# Altium schematic sheet btretro_main.SchDoc
size 508 x 431 mm
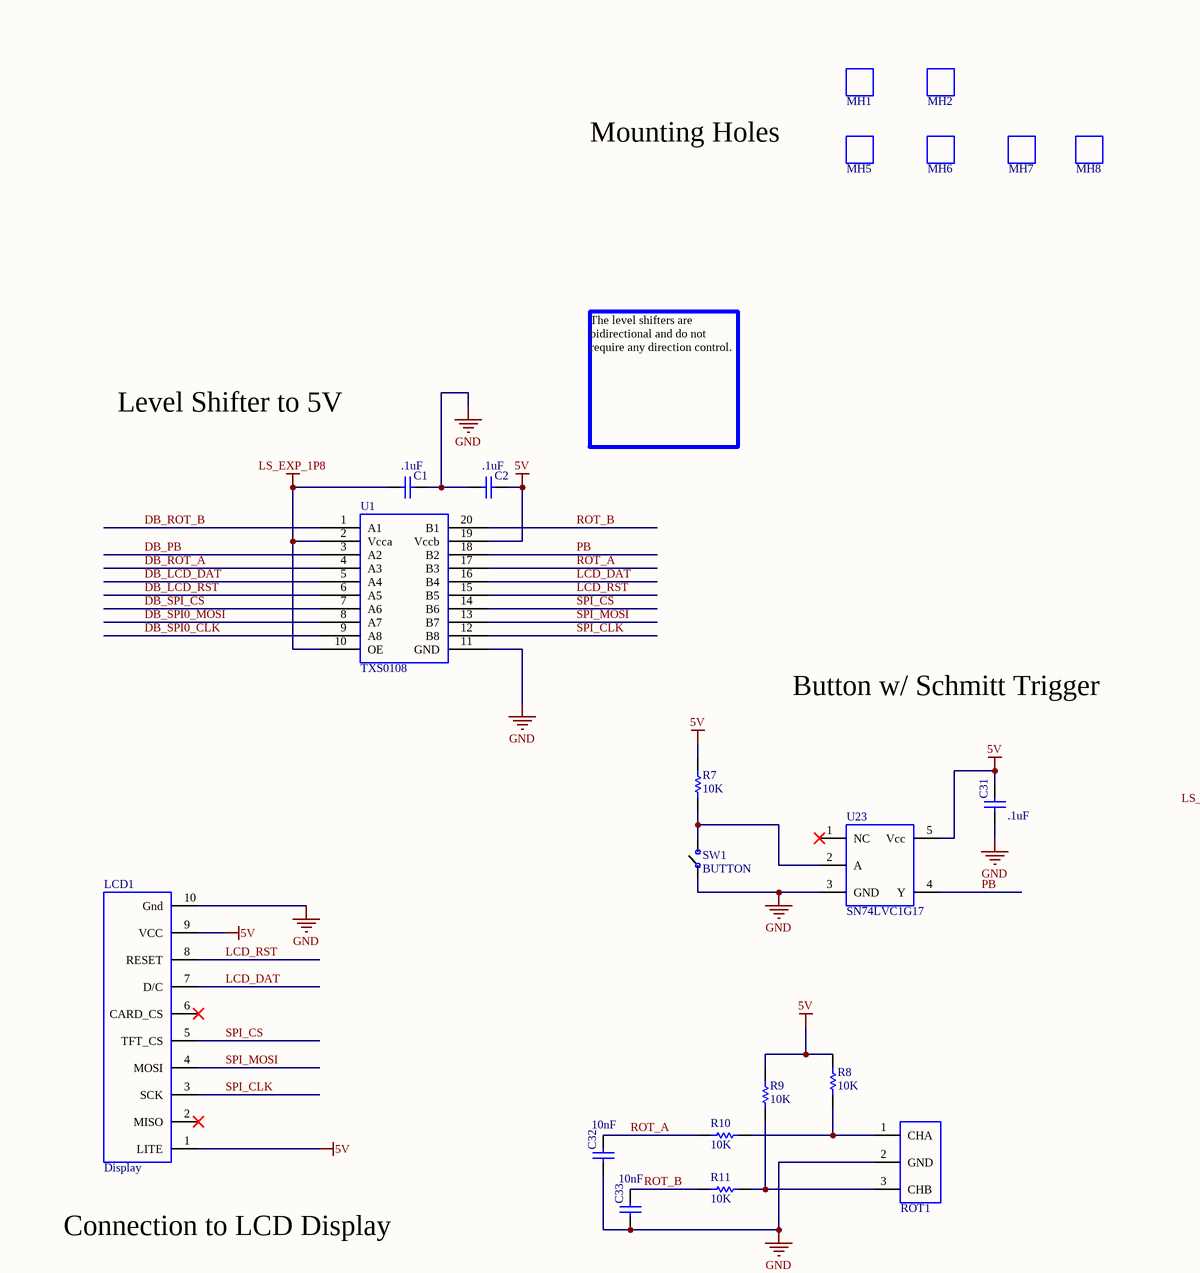
[diagram p0: btretro_main.SchDoc, top left]
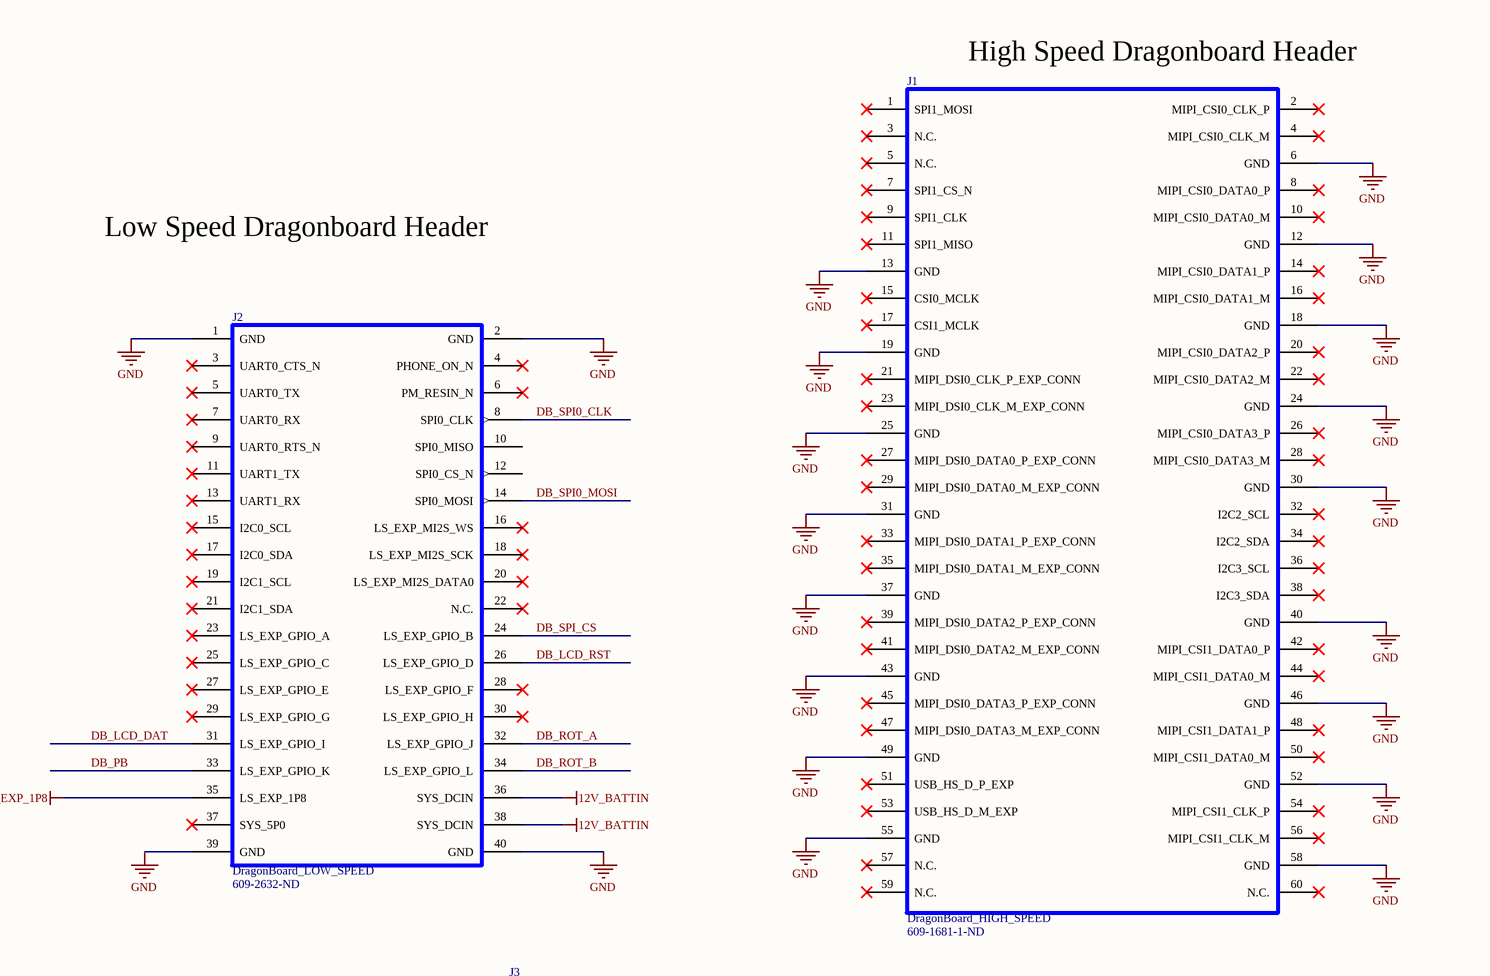
[diagram p1: btretro_main.SchDoc, top right]
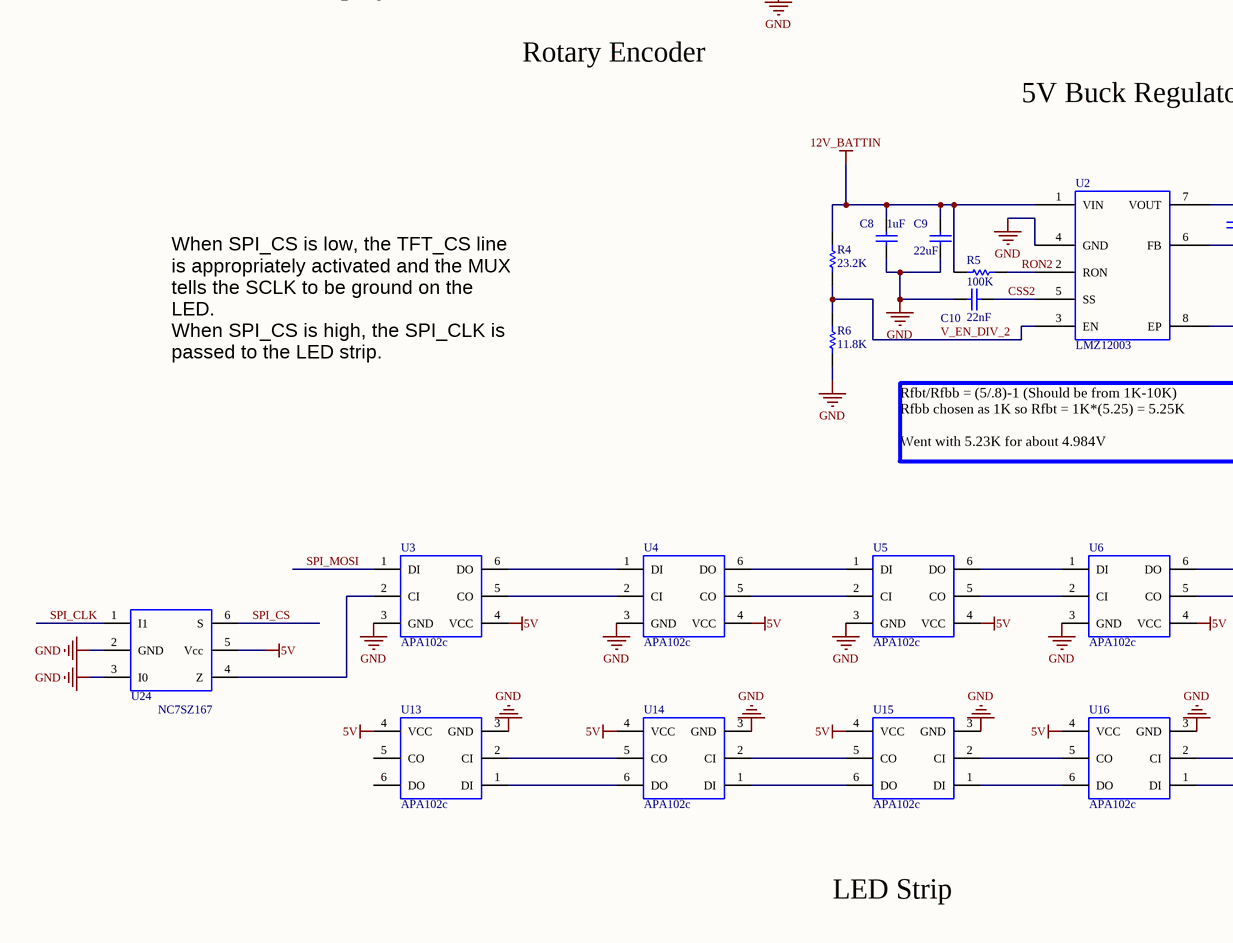
[diagram p2: btretro_main.SchDoc, bottom left]
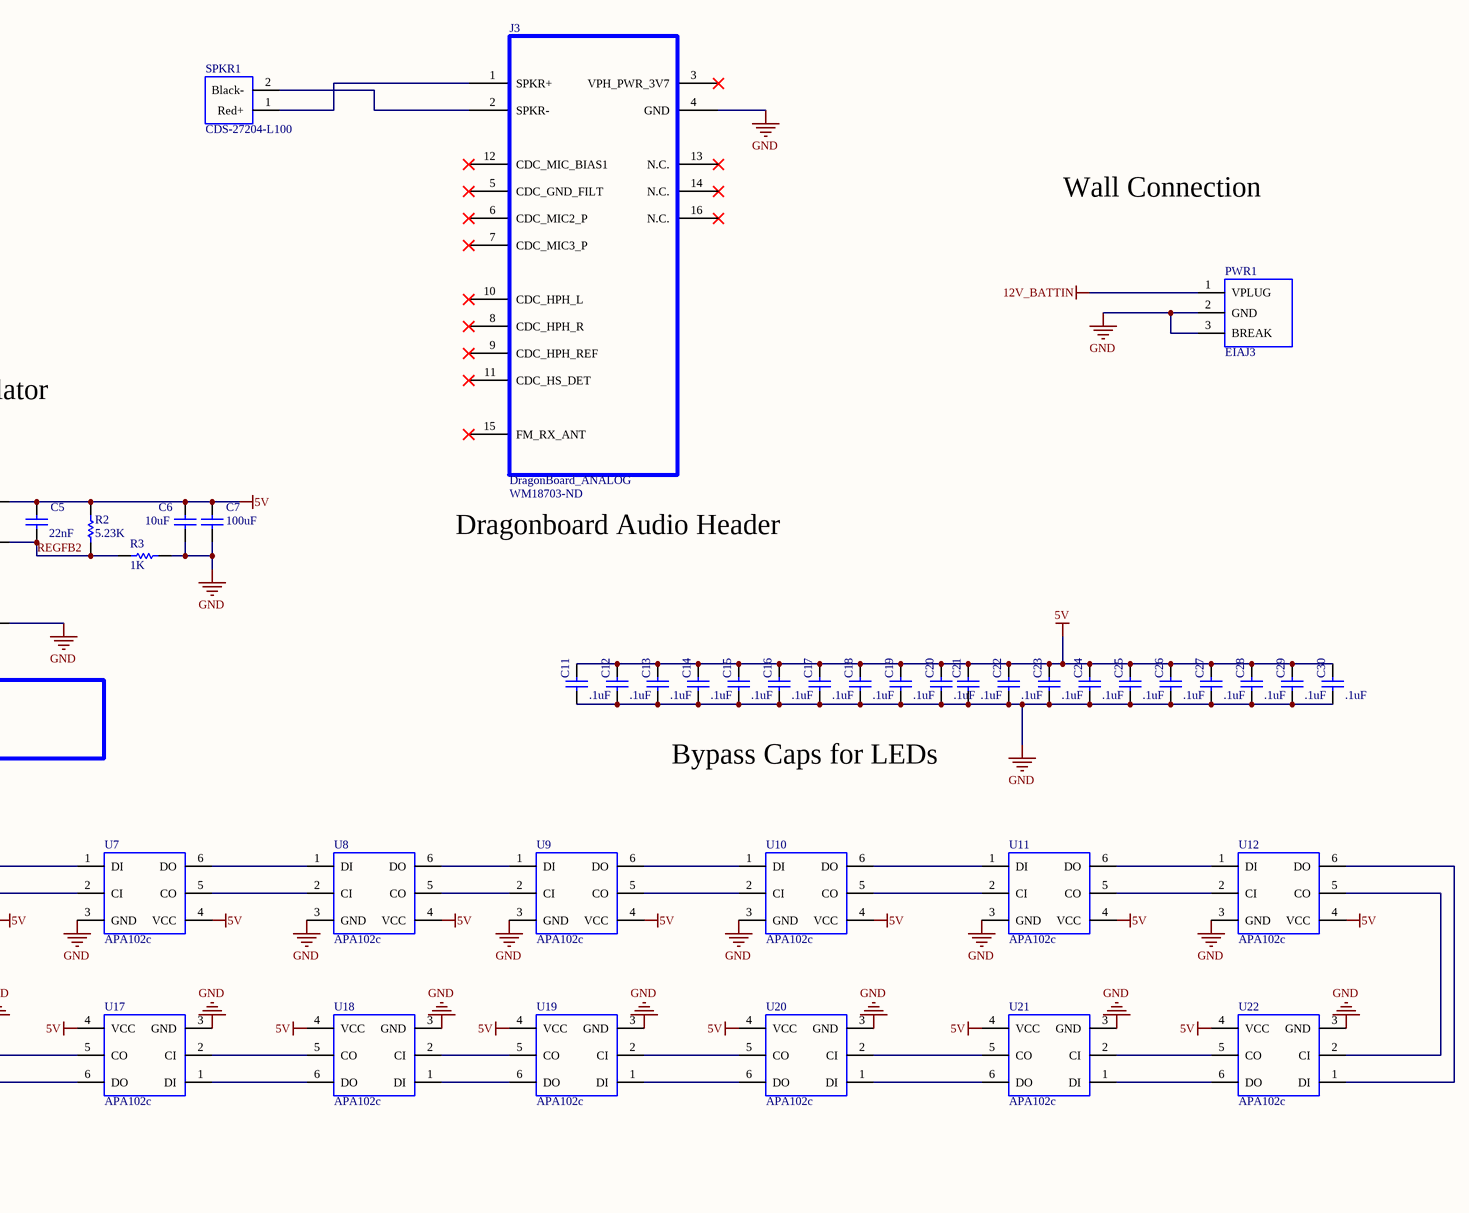
[diagram p3: btretro_main.SchDoc, bottom right]

## Parts
C1  value .1uF  [CAPC2012X135N]  (hidden comment: CAP_0805_.1u_250V)
C2  value .1uF  [CAPC2012X135N]  (hidden comment: CAP_0805_.1u_250V)
C5  value 22nF  [CAPC2012X135N]  (hidden comment: CAP_0805_m22n)
C6  value 10uF  [CAPC2012X135N]  (hidden comment: CAP_0805_10u_16V)
C7  value 100uF  [FP_1210]  (hidden comment: CAP_1210_100u_10V)
C8  value 1uF  [CAPC2012X135N]  (hidden comment: CAP_0805_1u_100V)
C9  value 22uF  [CAPC2012X135N]  (hidden comment: CAP_0805_22u_25V)
C10  value 22nF  [CAPC2012X135N]  (hidden comment: CAP_0805_m22n)
C11  value .1uF  [CAPC2012X135N]  (hidden comment: CAP_0805_.1u_250V)
C12  value .1uF  [CAPC2012X135N]  (hidden comment: CAP_0805_.1u_250V)
C13  value .1uF  [CAPC2012X135N]  (hidden comment: CAP_0805_.1u_250V)
C14  value .1uF  [CAPC2012X135N]  (hidden comment: CAP_0805_.1u_250V)
C15  value .1uF  [CAPC2012X135N]  (hidden comment: CAP_0805_.1u_250V)
C16  value .1uF  [CAPC2012X135N]  (hidden comment: CAP_0805_.1u_250V)
C17  value .1uF  [CAPC2012X135N]  (hidden comment: CAP_0805_.1u_250V)
C18  value .1uF  [CAPC2012X135N]  (hidden comment: CAP_0805_.1u_250V)
C19  value .1uF  [CAPC2012X135N]  (hidden comment: CAP_0805_.1u_250V)
C20  value .1uF  [CAPC2012X135N]  (hidden comment: CAP_0805_.1u_250V)
C21  value .1uF  [CAPC2012X135N]  (hidden comment: CAP_0805_.1u_250V)
C22  value .1uF  [CAPC2012X135N]  (hidden comment: CAP_0805_.1u_250V)
C23  value .1uF  [CAPC2012X135N]  (hidden comment: CAP_0805_.1u_250V)
C24  value .1uF  [CAPC2012X135N]  (hidden comment: CAP_0805_.1u_250V)
C25  value .1uF  [CAPC2012X135N]  (hidden comment: CAP_0805_.1u_250V)
C26  value .1uF  [CAPC2012X135N]  (hidden comment: CAP_0805_.1u_250V)
C27  value .1uF  [CAPC2012X135N]  (hidden comment: CAP_0805_.1u_250V)
C28  value .1uF  [CAPC2012X135N]  (hidden comment: CAP_0805_.1u_250V)
C29  value .1uF  [CAPC2012X135N]  (hidden comment: CAP_0805_.1u_250V)
C30  value .1uF  [CAPC2012X135N]  (hidden comment: CAP_0805_.1u_250V)
C31  value .1uF  [CAPC2012X135N]  (hidden comment: CAP_0805_.1u_250V)
C32  Capacitance: 10nF  [CAPC2012X135N]  (hidden comment: CAP_0805_10n_250V)
C33  Capacitance: 10nF  [CAPC2012X135N]  (hidden comment: CAP_0805_10n_250V)
J1  DragonBoard_HIGH_SPEED  Supplier Part Number 1: 609-1681-1-ND  [DB_HIGH_SPEED]
J2  DragonBoard_LOW_SPEED  Supplier Part Number 1: 609-2632-ND  [57202_40_PIN_HEADER]
J3  DragonBoard_ANALOG  Supplier Part Number 1: WM18703-ND  [16_PIN_ANALOG_CONN]
LCD1  Display  [LCD_HOLES]
MH1  MOUNTHOLES  [HOLE_BTRETRO]  (value not drawn)
MH2  MOUNTHOLES  [HOLE_BTRETRO]  (value not drawn)
MH5  MOUNTHOLES  [HOLE_BTRETRO]  (value not drawn)
MH6  MOUNTHOLES  [HOLE_BTRETRO]  (value not drawn)
MH7  MOUNTHOLES  [HOLE_BTRETRO]  (value not drawn)
MH8  MOUNTHOLES  [HOLE_BTRETRO]  (value not drawn)
PWR1  EIAJ3  [EIAJ3 BARREL]
R2  RES_5.23K  [RES0805]  (value not drawn)
R3  RES_0805_1K  [RES0805]  (value not drawn)
R4  RES_0805_23.2K  [RES0805]  (value not drawn)
R5  RES_0805_100K  [RES0805]  (value not drawn)
R6  RES_0805_11.8K  [RES0805]  (value not drawn)
R7  Resistance: 10K  [RES0805]  (hidden comment: RES_0805_10K)
R8  Resistance: 10K  [RES0805]  (hidden comment: RES_0805_10K)
R9  Resistance: 10K  [RES0805]  (hidden comment: RES_0805_10K)
R10  Resistance: 10K  [RES0805]  (hidden comment: RES_0805_10K)
R11  Resistance: 10K  [RES0805]  (hidden comment: RES_0805_10K)
ROT1  ROT_ENCODER  [ROTENCFP]  (value not drawn)
SPKR1  CDS-27204-L100  [SPK_BTRETRO]
SW1  BUTTON  [BUTTON]
U1  TXS0108  [TSSOP20]
U2  LMZ12003  [TO-PMOD-7]
U3  APA102c  [LED_APA]
U4  APA102c  [LED_APA]
U5  APA102c  [LED_APA]
U6  APA102c  [LED_APA]
U7  APA102c  [LED_APA]
U8  APA102c  [LED_APA]
U9  APA102c  [LED_APA]
U10  APA102c  [LED_APA]
U11  APA102c  [LED_APA]
U12  APA102c  [LED_APA]
U13  APA102c  [LED_APA]
U14  APA102c  [LED_APA]
U15  APA102c  [LED_APA]
U16  APA102c  [LED_APA]
U17  APA102c  [LED_APA]
U18  APA102c  [LED_APA]
U19  APA102c  [LED_APA]
U20  APA102c  [LED_APA]
U21  APA102c  [LED_APA]
U22  APA102c  [LED_APA]
U23  SN74LVC1G17  [DBV0005A (SOT-23)]
U24  NC7SZ167  [SC70]

## Nets
5V: C2.2 C5.2 C6.2 C7.2 C11.2 C12.2 C13.2 C14.2 C15.2 C16.2 C17.2 C18.2 C19.2 C20.2 C21.2 C22.2 C23.2 C24.2 C25.2 C26.2 C27.2 C28.2 C29.2 C30.2 C31.2 LCD1.1(LITE) LCD1.9(VCC) R2.2 R7.2 R8.2 R9.2 U1.19(Vccb) U2.7(VOUT) U3.4(VCC) U4.4(VCC) U5.4(VCC) U6.4(VCC) U7.4(VCC) U8.4(VCC) U9.4(VCC) U10.4(VCC) U11.4(VCC) U12.4(VCC) U13.4(VCC) U14.4(VCC) U15.4(VCC) U16.4(VCC) U17.4(VCC) U18.4(VCC) U19.4(VCC) U20.4(VCC) U21.4(VCC) U22.4(VCC) U23.5(Vcc) U24.5(Vcc)
12V_BATTIN: C8.2 C9.2 J2.36(SYS_DCIN) J2.38(SYS_DCIN) PWR1.1(VPLUG) R4.2 R5.1 U2.1(VIN)
GND: C1.2 C2.1 C6.1 C7.1 C8.1 C9.1 C10.1 C11.1 C12.1 C13.1 C14.1 C15.1 C16.1 C17.1 C18.1 C19.1 C20.1 C21.1 C22.1 C23.1 C24.1 C25.1 C26.1 C27.1 C28.1 C29.1 C30.1 C31.1 C32.1 C33.1 J1.6(GND) J1.12(GND) J1.13(GND) J1.18(GND) J1.19(GND) J1.24(GND) J1.25(GND) J1.30(GND) J1.31(GND) J1.37(GND) J1.40(GND) J1.43(GND) J1.46(GND) J1.49(GND) J1.52(GND) J1.55(GND) J1.58(GND) J2.1(GND) J2.2(GND) J2.39(GND) J2.40(GND) J3.4(GND) LCD1.10(Gnd) PWR1.2(GND) PWR1.3(BREAK) R3.2 R6.1 ROT1.2(GND) SW1.2 U1.11(GND) U2.4(GND) U2.8(EP) U3.3(GND) U4.3(GND) U5.3(GND) U6.3(GND) U7.3(GND) U8.3(GND) U9.3(GND) U10.3(GND) U11.3(GND) U12.3(GND) U13.3(GND) U14.3(GND) U15.3(GND) U16.3(GND) U17.3(GND) U18.3(GND) U19.3(GND) U20.3(GND) U21.3(GND) U22.3(GND) U23.3(GND) U24.2(GND) U24.3(I0)
LS_EXP_1P8: C1.1 J2.35(LS_EXP_1P8) U1.2(Vcca) U1.10(OE)
CSS2: C10.2 U2.5(SS)
DB_LCD_DAT: J2.31(LS_EXP_GPIO_I) U1.5(A4)
DB_LCD_RST: J2.26(LS_EXP_GPIO_D) U1.6(A5)
DB_PB: J2.33(LS_EXP_GPIO_K) U1.3(A2)
DB_ROT_A: J2.32(LS_EXP_GPIO_J) U1.4(A3)
DB_ROT_B: J2.34(LS_EXP_GPIO_L) U1.1(A1)
DB_SPI0_CLK: J2.8(SPI0_CLK) U1.9(A8)
DB_SPI0_MOSI: J2.14(SPI0_MOSI) U1.8(A7)
DB_SPI_CS: J2.24(LS_EXP_GPIO_B) U1.7(A6)
LCD_DAT: LCD1.7(D/C) U1.16(B4)
LCD_RST: LCD1.8(RESET) U1.15(B5)
PB: U1.18(B2) U23.4(Y)
REGFB2: C5.1 R2.1 R3.1 U2.6(FB)
RON2: R5.2 U2.2(RON)
ROT_A: C32.2 R10.1 U1.17(B3)
ROT_B: C33.2 R11.1 U1.20(B1)
SPI_CLK: LCD1.3(SCK) U1.12(B8) U24.1(I1)
SPI_CS: LCD1.5(TFT_CS) U1.14(B6) U24.6(S)
SPI_MOSI: LCD1.4(MOSI) U1.13(B7) U3.1(DI)
V_EN_DIV_2: R4.1 R6.2 U2.3(EN)
NetJ3_1: J3.1(SPKR+) SPKR1.1(Red+)
NetJ3_2: J3.2(SPKR-) SPKR1.2(Black-)
NetR7_1: R7.1 SW1.1 U23.2(A)
NetR8_1: R8.1 R10.2 ROT1.1(CHA)
NetR9_1: R9.1 R11.2 ROT1.3(CHB)
NetU3_2: U3.2(CI) U24.4(Z)
NetU3_5: U3.5(CO) U4.2(CI)
NetU3_6: U3.6(DO) U4.1(DI)
NetU4_5: U4.5(CO) U5.2(CI)
NetU4_6: U4.6(DO) U5.1(DI)
NetU5_5: U5.5(CO) U6.2(CI)
NetU5_6: U5.6(DO) U6.1(DI)
NetU6_5: U6.5(CO) U7.2(CI)
NetU6_6: U6.6(DO) U7.1(DI)
NetU7_5: U7.5(CO) U8.2(CI)
NetU7_6: U7.6(DO) U8.1(DI)
NetU8_5: U8.5(CO) U9.2(CI)
NetU8_6: U8.6(DO) U9.1(DI)
NetU9_5: U9.5(CO) U10.2(CI)
NetU9_6: U9.6(DO) U10.1(DI)
NetU10_5: U10.5(CO) U11.2(CI)
NetU10_6: U10.6(DO) U11.1(DI)
NetU11_5: U11.5(CO) U12.2(CI)
NetU11_6: U11.6(DO) U12.1(DI)
NetU12_5: U12.5(CO) U22.2(CI)
NetU12_6: U12.6(DO) U22.1(DI)
NetU13_1: U13.1(DI) U14.6(DO)
NetU13_2: U13.2(CI) U14.5(CO)
NetU14_1: U14.1(DI) U15.6(DO)
NetU14_2: U14.2(CI) U15.5(CO)
NetU15_1: U15.1(DI) U16.6(DO)
NetU15_2: U15.2(CI) U16.5(CO)
NetU16_1: U16.1(DI) U17.6(DO)
NetU16_2: U16.2(CI) U17.5(CO)
NetU17_1: U17.1(DI) U18.6(DO)
NetU17_2: U17.2(CI) U18.5(CO)
NetU18_1: U18.1(DI) U19.6(DO)
NetU18_2: U18.2(CI) U19.5(CO)
NetU19_1: U19.1(DI) U20.6(DO)
NetU19_2: U19.2(CI) U20.5(CO)
NetU20_1: U20.1(DI) U21.6(DO)
NetU20_2: U20.2(CI) U21.5(CO)
NetU21_1: U21.1(DI) U22.6(DO)
NetU21_2: U21.2(CI) U22.5(CO)

Not connected (* = marked no-connect by the designer): J1 1(SPI1_MOSI)* 2(MIPI_CSI0_CLK_P)* 3(N.C.)* 4(MIPI_CSI0_CLK_M)* 5(N.C.)* 7(SPI1_CS_N)* 8(MIPI_CSI0_DATA0_P)* 9(SPI1_CLK)* 10(MIPI_CSI0_DATA0_M)* 11(SPI1_MISO)* 14(MIPI_CSI0_DATA1_P)* 15(CSI0_MCLK)* 16(MIPI_CSI0_DATA1_M)* 17(CSI1_MCLK)* 20(MIPI_CSI0_DATA2_P)* 21(MIPI_DSI0_CLK_P_EXP_CONN)* 22(MIPI_CSI0_DATA2_M)* 23(MIPI_DSI0_CLK_M_EXP_CONN)* 26(MIPI_CSI0_DATA3_P)* 27(MIPI_DSI0_DATA0_P_EXP_CONN)* 28(MIPI_CSI0_DATA3_M)* 29(MIPI_DSI0_DATA0_M_EXP_CONN)* 32(I2C2_SCL)* 33(MIPI_DSI0_DATA1_P_EXP_CONN)* 34(I2C2_SDA)* 35(MIPI_DSI0_DATA1_M_EXP_CONN)* 36(I2C3_SCL)* 38(I2C3_SDA)* 39(MIPI_DSI0_DATA2_P_EXP_CONN)* 41(MIPI_DSI0_DATA2_M_EXP_CONN)* 42(MIPI_CSI1_DATA0_P)* 44(MIPI_CSI1_DATA0_M)* 45(MIPI_DSI0_DATA3_P_EXP_CONN)* 47(MIPI_DSI0_DATA3_M_EXP_CONN)* 48(MIPI_CSI1_DATA1_P)* 50(MIPI_CSI1_DATA0_M)* 51(USB_HS_D_P_EXP)* 53(USB_HS_D_M_EXP)* 54(MIPI_CSI1_CLK_P)* 56(MIPI_CSI1_CLK_M)* 57(N.C.)* 59(N.C.)* 60(N.C.)*; J2 3(UART0_CTS_N)* 4(PHONE_ON_N)* 5(UART0_TX)* 6(PM_RESIN_N)* 7(UART0_RX)* 9(UART0_RTS_N)* 10(SPI0_MISO) 11(UART1_TX)* 12(SPI0_CS_N) 13(UART1_RX)* 15(I2C0_SCL)* 16(LS_EXP_MI2S_WS)* 17(I2C0_SDA)* 18(LS_EXP_MI2S_SCK)* 19(I2C1_SCL)* 20(LS_EXP_MI2S_DATA0)* 21(I2C1_SDA)* 22(N.C.)* 23(LS_EXP_GPIO_A)* 25(LS_EXP_GPIO_C)* 27(LS_EXP_GPIO_E)* 28(LS_EXP_GPIO_F)* 29(LS_EXP_GPIO_G)* 30(LS_EXP_GPIO_H)* 37(SYS_5P0)*; J3 3(VPH_PWR_3V7)* 5(CDC_GND_FILT)* 6(CDC_MIC2_P)* 7(CDC_MIC3_P)* 8(CDC_HPH_R)* 9(CDC_HPH_REF)* 10(CDC_HPH_L)* 11(CDC_HS_DET)* 12(CDC_MIC_BIAS1)* 13(N.C.)* 14(N.C.)* 15(FM_RX_ANT)* 16(N.C.)*; LCD1 2(MISO)* 6(CARD_CS)*; U13 5(CO) 6(DO); U23 1(NC)*

## Notes on the sheet
- (near J1) High Speed Dragonboard Header
- Mounting Holes
- Low Speed Dragonboard Header
- Level Shifter to 5V
- The level shifters are bidirectional and do not require any direction control.
- Button w/ Schmitt Trigger
- Wall Connection
- Connection to LCD Display
- Rotary Encoder
- 5V Buck Regulator
- Dragonboard Audio Header
- When SPI_CS is low, the TFT_CS line is appropriately activated and the MUX tells the SCLK to be ground on the LED.
  When SPI_CS is high, the SPI_CLK is passed to the LED strip.
- Rfbt/Rfbb = (5/.8)-1 (Should be from 1K-10K)
  Rfbb chosen as 1K so Rfbt = 1K*(5.25) = 5.25K
  Went with 5.23K for about 4.984V
- Bypass Caps for LEDs
- LED Strip
- (in symbol RES_0805_1K) 1K
- (in symbol RES_0805_5.23K) 5.23K
- (in symbol RES_0805_11.8K) 11.8K
- (in symbol RES_0805_23.2K) 23.2K
- (in symbol RES_0805_100K) 100K

## Library data of the parts
C1 C2 C11-C31 = CAP_0805_.1u_250V: Cap Ceramic 0.1uF 250V X7T 10% SMD 0805 125C Plastic T/R; Manufacturer: TDK; Manufacturer Part Number: C2012X7T2E104K125AE; Capacitance: 100nF; Supplier 1: Digi-Key; Supplier Part Number 1: 445-8883-1-ND; Stock 1: 30376; Pricing 1: 1=0.37, 10=0.25, 100=0.1419, 500=0.1002, 1000=0.0877 (USD); Case/Package: 0805; Weight: 0.000194oz; Case Code (Metric): 2012; Case Code (Imperial): 0805; Min Operating Temperature: -55°C; Max Operating Temperature: 125°C; Package Quantity: 1; Voltage Rating: 250V; Tolerance: 10%; Packaging: Tape and Reel; Voltage Rating (DC): 250V; Dielectric: X7T; Termination: SMD/SMT; Composition: Ceramic; Length: 2mm; Height: 1.25mm; Width: 0.05inch; Thickness: 0.049inch; Depth: 1.25mm; REACH SVHC: No SVHC; ComponentLink1URL: https://datasheet.ciiva.com/24219/c2012x7t2e104k125ae-265154-24219519.pdf; ComponentLink1Description: https://datasheet.ciiva.com/24219/c2012x7t2e104k125ae-265154-24219519.pdf
C5 C10 = CAP_0805_22n_100V: CAP CER 0.022UF 100V X7R 0805; Manufacturer: TDK; Manufacturer Part Number: CGJ4J2X7R2A223K125AA; Tolerance: 10%; Supplier 1: Digi-Key; Supplier Part Number 1: 445-9184-1-ND; Stock 1: 2508; Pricing 1: 1=0.42, 10=0.292, 100=0.175, 500=0.1312, 1000=0.1108 (USD); Case/Package: 0805; Weight: 0.000194oz; Case Code (Metric): 2012; Case Code (Imperial): 0805; Min Operating Temperature: -55°C; Max Operating Temperature: 125°C; Package Quantity: 1; Capacitance: 22nF; Voltage Rating: 100V; Packaging: Tape and Reel; Voltage Rating (DC): 100V; Dielectric: X7R; Termination: SMD/SMT; Composition: Ceramic; Length: 0.08inch; Height: 1.25mm; Width: 0.05inch; Thickness: 0.057inch; ComponentLink1URL: http://www.mouser.com/ds/2/400/lcc_highreliability_midvoltage_en-520194.pdf; ComponentLink1Description: http://www.mouser.com/ds/2/400/lcc_highreliability_midvoltage_en-520194.pdf; ComponentLink2URL: http://product.tdk.com/capacitor/mlcc/en/documents/mlccspec_highreliability_en.pdf; ComponentLink2Description: http://product.tdk.com/capacitor/mlcc/en/documents/mlccspec_highreliability_en.pdf
C6 = CAP_0805_10u_16V: Cap Ceramic 10uF 16V X5R 10% SMD 0805 85C T/R; Manufacturer: Johanson Dielectrics; Manufacturer Part Number: 160R15X106KV4E; Supplier 1: Digi-Key; Supplier Part Number 1: 709-1229-1-ND; Stock 1: 36636; Pricing 1: 1=0.55, 10=0.387, 100=0.2552, 500=0.189, 1000=0.1607 (USD); Mount: Surface Mount; Case/Package: 0805; Number of Pins: 2; Weight: 0.000194oz; Case Code (Imperial): 0805; Case Code (Metric): 2012; Min Operating Temperature: -55°C; Max Operating Temperature: 85°C; Voltage Rating: 16V; Capacitance: 10uF; Voltage Rating (DC): 16V; Tolerance: 10%; Packaging: Tape and Reel; Package Quantity: 2000; Dielectric: X5R; Termination: SMD/SMT; Length: 2.03mm; Height: 1.27mm; Width: 1.27mm; Thickness: 0.06inch; Depth: 1.27mm; Radiation Hardening: No; REACH SVHC: No SVHC; ComponentLink1URL: https://datasheet.ciiva.com/26948/getdatasheetpartid-132904-26948555.pdf; ComponentLink1Description: https://datasheet.ciiva.com/26948/getdatasheetpartid-132904-26948555.pdf
C7 = CAP_1210_100u_10V: Cap Ceramic 100uF 10V X5R 20% SMD 1210 85C Embossed T/R; Manufacturer: Murata; Manufacturer Part Number: GRM32ER61A107ME20L; Dissipation Factor: 0.035%; Supplier 1: Digi-Key; Supplier Part Number 1: 490-9969-1-ND; Stock 1: 195702; Pricing 1: 1=1.08, 10=0.822, 100=0.5882, 500=0.4554 (USD); Case/Package: 1210; Weight: 0.00388oz; Case Code (Metric): 3225; Material: Ceramic; Case Code (Imperial): 1210; Dielectric Material: Ceramic; Min Operating Temperature: -55°C; Max Operating Temperature: 85°C; Capacitance: 100uF; Tolerance: 20%; Packaging: Tape and Reel; Dielectric: X5R; Voltage Rating: 10V; Voltage: 10V; Termination: SMD/SMT; Voltage Rating (DC): 10V; Package Quantity: 1000; Length: 3.2mm; Height: 2.5mm; Width: 2.5mm; Thickness: 0.106inch; Depth: 2.5mm; REACH SVHC: No SVHC; Lead Free: Lead Free; ComponentLink1URL: http://components.arrow.com/part/dataview/0323_06932945; ComponentLink1Description: http://components.arrow.com/part/dataview/0323_06932945; ComponentLink2URL: http://www.mouser.com/ds/2/281/c02e-2905.pdf; ComponentLink2Description: http://www.mouser.com/ds/2/281/c02e-2905.pdf; ComponentLink3URL: http://www.farnell.com/datasheets/2079200.pdf; ComponentLink3Description: http://www.farnell.com/datasheets/2079200.pdf; ComponentLink4URL: http://psearch.en.murata.com/capacitor/product/GRM32ER61A107ME20%23.pdf; ComponentLink4Description: http://psearch.en.murata.com/capacitor/product/GRM32ER61A107ME20%23.pdf
C8 = CAP_0805_1u_100V: CAP CER 1UF 100V X7S 0805; Manufacturer: TDK; Manufacturer Part Number: C2012X7S2A105K125AE; Tolerance: 10%; Supplier 1: Digi-Key; Supplier Part Number 1: 445-8887-1-ND; Stock 1: 75778; Pricing 1: 1=0.46, 10=0.327, 100=0.2152, 500=0.1594, 1000=0.1355 (USD); Case/Package: 0805; Case Code (Metric): 2012; Case Code (Imperial): 0805; Min Operating Temperature: -55°C; Max Operating Temperature: 125°C; Package Quantity: 1; Capacitance: 1uF; Voltage Rating: 100V; Packaging: Tape and Reel; Voltage Rating (DC): 100V; Dielectric: X7S; Termination: SMD/SMT; Composition: Ceramic; Length: 2mm; Height: 1.25mm; Width: 0.05inch; Thickness: 0.049inch; Depth: 1.25mm; Lead Free: Lead Free; ComponentLink1URL: https://datasheet.ciiva.com/6252/mlcc-commercial-soft-en-6252535.pdf; ComponentLink1Description: https://datasheet.ciiva.com/6252/mlcc-commercial-soft-en-6252535.pdf; ComponentLink2URL: https://datasheet.ciiva.com/6252/mlcc-commercial-soft-en-6252538.pdf; ComponentLink2Description: https://datasheet.ciiva.com/6252/mlcc-commercial-soft-en-6252538.pdf; ComponentLink3URL: https://datasheet.ciiva.com/6252/mlcc-commercial-soft-en-6252540.pdf; ComponentLink3Description: https://datasheet.ciiva.com/6252/mlcc-commercial-soft-en-6252540.pdf; ComponentLink4URL: https://datasheet.ciiva.com/24219/c2012x7s2a105k125ae-265181-24219982.pdf; ComponentLink4Description: https://datasheet.ciiva.com/24219/c2012x7s2a105k125ae-265181-24219982.pdf
C9 = CAP_0805_22u_25V: 22µF ±20% 25V X5R Ceramic Capacitor -55°C ~ 85°C Surface Mount, MLCC 0805 (2012 Metric) 0.079" L x 0.049" W (2.00mm x 1.25mm); Manufacturer: Samsung; Manufacturer Part Number: CL21A226MAQNNNE; Supplier 1: Digi-Key; Supplier Part Number 1: 1276-2908-1-ND; Stock 1: 536403; Pricing 1: 1=0.92, 10=0.678, 100=0.465, 500=0.3681, 1000=0.31 (USD); Mount: Surface Mount; Case/Package: 0805; Case Code (Metric): 2012; Case Code (Imperial): 0805; Contact Plating: Nickel,Tin; Min Operating Temperature: -55°C; Max Operating Temperature: 85°C; Package Quantity: 1; Packaging: Tape and Reel; Capacitance: 22uF; Tolerance: 20%; Voltage Rating: 25V; Dielectric: X5R; Termination: Wraparound; Length: 2mm; Width: 0.049inch; Thickness: 0.055inch; Depth: 1.25mm; ComponentLink1URL: https://datasheet.ciiva.com/25724/cl21a226maqnnne-25724468.pdf; ComponentLink1Description: https://datasheet.ciiva.com/25724/cl21a226maqnnne-25724468.pdf
C32 C33 = CAP_0805_10n_250V: Cap Ceramic 0.1uF 250V X7T 10% SMD 0805 125C Plastic T/R; Manufacturer: TDK; Manufacturer Part Number: C2012X7R2E103K125AA; Dielectric: X7R; Case Code (Metric): 2012; Case Code (Imperial): 0805; Supplier 1: Digi-Key; Stock 1: 156464; Pricing 1: 1=0.19, 10=0.135, 100=0.0633, 500=0.0444, 1000=0.0367 (USD); Mount: Surface Mount; Case/Package: 0805; Number of Pins: 2; Weight: 0.000194oz; Min Operating Temperature: -55°C; Max Operating Temperature: 125°C; Packaging: Tape and Reel; Package Quantity: 1; Termination: SMD/SMT; Tolerance: 10%; Voltage Rating: 250V; Voltage Rating (DC): 250V; Composition: Ceramic; Length: 2mm; Height: 1.25mm; Width: 0.049inch; Thickness: 0.053inch; Depth: 1.25mm; Lead Free: Lead Free; REACH SVHC: No SVHC; ComponentLink1URL: https://datasheet.ciiva.com/24219/c2012x7r2e103k125aa-265098-24219253.pdf; ComponentLink1Description: https://datasheet.ciiva.com/24219/c2012x7r2e103k125aa-265098-24219253.pdf; ComponentLink2URL: https://datasheet.ciiva.com/22684/1484596-22684119.pdf; ComponentLink2Description: https://datasheet.ciiva.com/22684/1484596-22684119.pdf; ComponentLink3URL: https://datasheet.ciiva.com/7975/1833281-7975113.pdf; ComponentLink3Description: https://datasheet.ciiva.com/7975/1833281-7975113.pdf; ComponentLink4URL: https://datasheet.ciiva.com/28602/1484596-28602284.pdf; ComponentLink4Description: https://datasheet.ciiva.com/28602/1484596-28602284.pdf; ComponentLink5URL: https://datasheet.ciiva.com/16427/e412-c-16427789.pdf; ComponentLink5Description: https://datasheet.ciiva.com/16427/e412-c-16427789.pdf; Supplier Part Number 1: 445-2280-1-ND
J1 = DragonBoard_HIGH_SPEED: 60 Position Connector Plug, Center Strip Contacts Surface Mount Gold; Manufacturer: Amphenol FCI; Manufacturer Part Number: 61083-064402LF; Contact Resistance: 50mR; Number of Positions: 60; Max Voltage Rating (AC): 100V; Current Rating: 500mA; Gender: Male; Pitch: 0.8mm; Stack Height: 7.7mm; Supplier 1: Digi-Key; Stock 1: 579; Pricing 1: 1=6.36, 10=6.094, 25=5.5644, 50=5.2994, 100=5.0344, 250=4.5044 (USD); Mount: Surface Mount; Case/Package: SMD/SMT; Contact Plating: Nickel,Gold; Contact Material: Brass,Copper Alloy; Housing Material: Polymer; Min Operating Temperature: -40°C; Max Operating Temperature: 125°C; Number of Rows: 2; Packaging: Tape and Reel; Package Quantity: 600; Connector Type: Plug; Termination: Solder; Number of Contacts: 60; Orientation: Straight; Voltage Rating: 100V; Length: 29.8mm; Depth: 6mm; Width: 6mm; Lead Free: Lead Free; Flammability Rating: UL94 V-0; ComponentLink1URL: https://datasheet.ciiva.com/15208/getdatasheetpartid-64898-15208309.pdf; ComponentLink1Description: https://datasheet.ciiva.com/15208/getdatasheetpartid-64898-15208309.pdf; ComponentLink2URL: https://datasheet.ciiva.com/17088/70248518-17088294.pdf; ComponentLink2Description: https://datasheet.ciiva.com/17088/70248518-17088294.pdf; ComponentLink3URL: https://datasheet.ciiva.com/394/61083-394311.pdf; ComponentLink3Description: https://datasheet.ciiva.com/394/61083-394311.pdf; ComponentLink4URL: https://datasheet.ciiva.com/5129/61083-5129495.pdf; ComponentLink4Description: https://datasheet.ciiva.com/5129/61083-5129495.pdf; ComponentLink5URL: https://datasheet.ciiva.com/10034/61083-10034439.pdf; ComponentLink5Description: https://datasheet.ciiva.com/10034/61083-10034439.pdf; ComponentLink6URL: https://datasheet.ciiva.com/394/61083-394312.pdf; ComponentLink6Description: https://datasheet.ciiva.com/394/61083-394312.pdf; ComponentLink7URL: https://datasheet.ciiva.com/394/61083-394313.pdf; ComponentLink7Description: https://datasheet.ciiva.com/394/61083-394313.pdf
J2 = DragonBoard_LOW_SPEED: 40 Positions Header, Unshrouded Connector 0.079" (2.00mm) Surface Mount Gold, GXT™; Manufacturer: Amphenol FCI; Manufacturer Part Number: 57202-G52-20LF; Number of Positions: 40; Insulation Resistance: 1GR; Max Voltage Rating (AC): 650V; Gender: Male; Connector Type: Male Pin; Contact Resistance: 25mR; Current Rating: 2A; Pitch: 2mm; Row Spacing: 0.079inch; Mating Post Length: 4mm; Supplier 1: Digi-Key; Stock 1: 3189; Pricing 1: 1=4.58, 10=4.395, 100=3.6624, 500=3.113, 1000=2.6552 (USD); Mount: Surface Mount; Contact Plating: Nickel,Gold,GXT; Contact Material: Bronze,Copper Alloy; Colour: Black; Housing Colour: Black; Housing Material: Thermoplastic; Min Operating Temperature: -55°C; Max Operating Temperature: 125°C; Package Quantity: 100; Packaging: Bulk; Number of Rows: 2; Termination: Solder; Number of Contacts: 40; Orientation: Straight; Contact Gender: Male; Voltage Rating: 650V; Length: 40mm; Depth: 4mm; Width: 4mm; Contact Mating Length: 0.157inch; Radiation Hardening: No; REACH SVHC: No SVHC; Lead Free: Lead Free; ComponentLink1URL: https://datasheet.ciiva.com/9473/57202-9473862.pdf; ComponentLink1Description: https://datasheet.ciiva.com/9473/57202-9473862.pdf; ComponentLink2URL: https://datasheet.ciiva.com/711/57202-711726.pdf; ComponentLink2Description: https://datasheet.ciiva.com/711/57202-711726.pdf
J3 = DragonBoard_ANALOG: Conn Socket Strip RCP 16 POS 2mm Solder ST SMD Tube; Manufacturer: Molex; Manufacturer Part Number: 0791091007; Connector Type: Receptacle,Socket; Number of Positions: 16; Gender: Female; Max Voltage Rating (AC): 125V; Contact Resistance: 25mR; Row Spacing: 0.079inch; Supplier 1: Digi-Key; Stock 1: 8937; Pricing 1: 1=2.66, 10=2.554, 100=2.1284, 500=1.8091, 1000=1.5431, 5000=1.3835 (USD); Case/Package: SMD/SMT; Colour: Black; Contact Plating: Nickel,Gold; Contact Material: Bronze; Housing Colour: Black; Housing Material: Polymer; Min Operating Temperature: -55°C; Max Operating Temperature: 105°C; Packaging: Rail/Tube; Number of Rows: 2; Termination: Solder; Number of Contacts: 16; Orientation: Straight; Length: 16.19mm; Pitch: 2mm; Depth: 4.19mm; ComponentLink1URL: https://datasheet.ciiva.com/10078/0791091007-pcb-receptacles-10078749.pdf; ComponentLink1Description: https://datasheet.ciiva.com/10078/0791091007-pcb-receptacles-10078749.pdf
LCD1 = LCD_SCREEN_BTRETRO: TFT Display
MH1 MH2 MH5-MH8 = MOUNTHOLES: HOLE
PWR1 = EIAJ3: PJ1-021 Series 1.65 mm x 5.15 mm 16 V Right Angle SMT Power Jack; Manufacturer: CUI; Manufacturer Part Number: PJ1-021-SMT-TR; Gender: Male; Shielding: Unshielded; Current Rating: 5A; Voltage Rating: 24V; Insulation Resistance: 100MR; Number of Conductors: 2; Supplier 1: Digi-Key; Stock 1: 15825; Pricing 1: 1=0.89, 10=0.783, 25=0.7364, 50=0.7058, 100=0.6752, 250=0.6138 (USD); Mount: Surface Mount; Case/Package: SMD/SMT; Colour: Black; Contact Material: Brass; Contact Plating: Silver; Housing Colour: Black; Housing Material: Thermoplastic; Min Operating Temperature: -25°C; Max Operating Temperature: 85°C; Package Quantity: 500; Termination: SMD/SMT; Connector Type: Jack; Contact Gender: Male; Packaging: Tape and Reel; Orientation: Horizontal; Lead Free: Lead Free; Flammability Rating: UL94 V-0; ComponentLink1URL: http://www.mouser.com/ds/2/670/pj1-021-smt-528091.pdf; ComponentLink1Description: http://www.mouser.com/ds/2/670/pj1-021-smt-528091.pdf; ComponentLink2URL: http://www.cui.com/product/resource/digikeypdf/pj1-021-smt.pdf; ComponentLink2Description: http://www.cui.com/product/resource/digikeypdf/pj1-021-smt.pdf; ComponentLink3URL: http://www.cui.com/Product/Resource/FuturePDF/PJ1-021-SMT.pdf; ComponentLink3Description: http://www.cui.com/Product/Resource/FuturePDF/PJ1-021-SMT.pdf; Supplier Part Number 1: CP1-021PJCT-ND
R2 = RES_0805_5.23K: Thick Film Resistors 5.23K OHM 1%; Manufacturer: Yageo; Manufacturer Part Number: RC0805FR-075K23L; Resistance: 5.23KR; Power Rating: 125mW; Voltage Rating: 150V; Temperature Coefficient: 100ppm/°C; Supplier 1: Digi-Key; Supplier Part Number 1: 311-5.23KCRCT-ND; Stock 1: 101854; Pricing 1: 1=0.1, 10=0.022, 100=0.0088, 1000=0.004, 2500=0.0034 (USD); Case/Package: 0805; Weight: 0.000194oz; Case Code (Imperial): 0805; Case Code (Metric): 2012; Contact Plating: Tin,Matte; Min Operating Temperature: -55°C; Max Operating Temperature: 155°C; Tolerance: 1%; Packaging: Tape and Reel; Termination: SMD/SMT; Composition: Thick Film; Military Standard: Not; Voltage Rating (DC): 150V; Length: 2mm; Height: 0.5mm; Width: 1.25mm; Depth: 1.25mm; Radiation Hardening: No; Lead Free: Lead Free; ComponentLink1URL: https://datasheet.ciiva.com/12577/rc0805-12577289.pdf; ComponentLink1Description: https://datasheet.ciiva.com/12577/rc0805-12577289.pdf
R3 = RES_0805_1K: RES SMD 1K OHM 1% 1/8W 0805; Manufacturer: Yageo; Manufacturer Part Number: RC0805FR-071KL; Resistance: 1KR; Temperature Coefficient: 100ppm/°C; Voltage Rating (DC): 150V; Power Rating: 125mW; Supplier 1: Digi-Key; Supplier Part Number 1: 311-1.00KCRCT-ND; Stock 1: 6122451; Pricing 1: 1=0.1, 10=0.022, 100=0.0088, 1000=0.004, 2500=0.0034 (USD); Case/Package: 0805; Number of Pins: 2; Case Code (Metric): 2012; Case Code (Imperial): 0805; Min Operating Temperature: -55°C; Max Operating Temperature: 155°C; Tolerance: 1%; Packaging: Tape and Reel; Composition: Thick Film; Package Quantity: 1; Voltage Rating: 150V; Number of Terminations: 2; Termination: SMD/SMT; Military Standard: Not; Max Power Dissipation: 125mW; Length: 0.079inch; Height: 0.024inch; Width: 0.049inch; Depth: 1.25mm; REACH SVHC: Unknown; Lead Free: Lead Free; ComponentLink1URL: https://datasheet.ciiva.com/2456/pyu-r-int-thick-7-2456976.pdf; ComponentLink1Description: https://datasheet.ciiva.com/2456/pyu-r-int-thick-7-2456976.pdf; ComponentLink2URL: https://datasheet.ciiva.com/2456/pyu-r-int-thick-7-2456977.pdf; ComponentLink2Description: https://datasheet.ciiva.com/2456/pyu-r-int-thick-7-2456977.pdf; ComponentLink3URL: https://datasheet.ciiva.com/11819/0900766b8106beab-11819814.pdf; ComponentLink3Description: https://datasheet.ciiva.com/11819/0900766b8106beab-11819814.pdf; ComponentLink4URL: https://datasheet.ciiva.com/7941/1686128-7941719.pdf; ComponentLink4Description: https://datasheet.ciiva.com/7941/1686128-7941719.pdf; ComponentLink5URL: https://datasheet.ciiva.com/16850/rc0805-16850409.pdf; ComponentLink5Description: https://datasheet.ciiva.com/16850/rc0805-16850409.pdf; ComponentLink6URL: https://datasheet.ciiva.com/46385/444164-46385020.pdf; ComponentLink6Description: https://datasheet.ciiva.com/46385/444164-46385020.pdf; ComponentLink7URL: https://datasheet.ciiva.com/2456/pyu-r-int-thick-7-2456975.pdf; ComponentLink7Description: https://datasheet.ciiva.com/2456/pyu-r-int-thick-7-2456975.pdf
R4 = RES_0805_23.2K: RESISTOR, THICK FILM, 23.2KOHM, 125mW, ± 1%; Manufacturer: Panasonic ECG; Manufacturer Part Number: ERJ-6ENF2322V; Resistance: 23.2KR; Voltage Rating: 150V; Temperature Coefficient: 100ppm/°C; Supplier 1: Digi-Key; Supplier Part Number 1: P23.2KCCT-ND; Stock 1: 76814; Pricing 1: 1=0.1, 10=0.041, 100=0.0167, 1000=0.0075, 2500=0.0065 (USD); Mount: Surface Mount; Case/Package: 0805; Case Code (Metric): 2012; Case Code (Imperial): 0805; Contact Plating: Tin; Min Operating Temperature: -55°C; Max Operating Temperature: 155°C; Tolerance: 1%; Power Rating: 125mW; Packaging: Tape and Reel; Package Quantity: 1; Composition: Thick Film; Number of Terminations: 2; Termination: Solder; Military Standard: Not; Max Power Dissipation: 125mW; Voltage Rating (DC): 150V; Length: 2mm; Height: 0.6mm; Width: 0.049inch; Depth: 1.25mm; REACH SVHC: Unknown; Lead Free: Lead Free; ComponentLink1URL: https://datasheet.ciiva.com/16766/70260748-16766008.pdf; ComponentLink1Description: https://datasheet.ciiva.com/16766/70260748-16766008.pdf; ComponentLink2URL: https://datasheet.ciiva.com/16770/70260748-16770232.pdf; ComponentLink2Description: https://datasheet.ciiva.com/16770/70260748-16770232.pdf; ComponentLink3URL: https://datasheet.ciiva.com/24026/aoa0000ce2-24026235.pdf; ComponentLink3Description: https://datasheet.ciiva.com/24026/aoa0000ce2-24026235.pdf; ComponentLink4URL: https://datasheet.ciiva.com/15829/aoa0000ce2-15829836.pdf; ComponentLink4Description: https://datasheet.ciiva.com/15829/aoa0000ce2-15829836.pdf; ComponentLink5URL: https://datasheet.ciiva.com/30086/aoa0000ce2-30086557.pdf; ComponentLink5Description: https://datasheet.ciiva.com/30086/aoa0000ce2-30086557.pdf; ComponentLink6URL: https://datasheet.ciiva.com/28548/1694929-28548334.pdf; ComponentLink6Description: https://datasheet.ciiva.com/28548/1694929-28548334.pdf; ComponentLink7URL: https://datasheet.ciiva.com/7870/aoa0000ce2-7870831.pdf; ComponentLink7Description: https://datasheet.ciiva.com/7870/aoa0000ce2-7870831.pdf
R5 = RES_0805_100K: Res Thick Film 0805 100K Ohm 1% 0.125W(1/8W) ±100ppm/C Molded SMD Automotive Punched T/R; Manufacturer: Panasonic ECG; Manufacturer Part Number: ERJ-6ENF1003V; Resistance: 100KR; Power Rating: 125mW; Temperature Coefficient: 100ppm/°C; Voltage Rating (DC): 150V; Supplier 1: Digi-Key; Supplier Part Number 1: P100KCCT-ND; Stock 1: 219769; Pricing 1: 1=0.1, 10=0.041, 100=0.0167, 1000=0.0075, 2500=0.0065 (USD); Mount: Surface Mount; Case/Package: 0805; Number of Pins: 2; Case Code (Metric): 2012; Case Code (Imperial): 0805; Contact Plating: Tin; Min Operating Temperature: -55°C; Max Operating Temperature: 155°C; Tolerance: 1%; Packaging: Tape and Reel; Package Quantity: 1; Voltage Rating: 150V; Composition: Thick Film; Number of Terminations: 2; Military Standard: Not; Termination: SMD/SMT; Max Power Dissipation: 125mW; Length: 2mm; Height: 0.6mm; Width: 0.049inch; Depth: 1.25mm; Radiation Hardening: No; REACH SVHC: No SVHC; Lead Free: Lead Free; ComponentLink1URL: https://datasheet.ciiva.com/11821/0900766b80f80784-11821507.pdf; ComponentLink1Description: https://datasheet.ciiva.com/11821/0900766b80f80784-11821507.pdf; ComponentLink2URL: https://datasheet.ciiva.com/22723/426256-22723909.pdf; ComponentLink2Description: https://datasheet.ciiva.com/22723/426256-22723909.pdf; ComponentLink3URL: https://datasheet.ciiva.com/46419/1678782-46419877.pdf; ComponentLink3Description: https://datasheet.ciiva.com/46419/1678782-46419877.pdf; ComponentLink4URL: https://datasheet.ciiva.com/27055/1988989-27055734.pdf; ComponentLink4Description: https://datasheet.ciiva.com/27055/1988989-27055734.pdf; ComponentLink5URL: https://datasheet.ciiva.com/16449/aoa0000ce2-16449480.pdf; ComponentLink5Description: https://datasheet.ciiva.com/16449/aoa0000ce2-16449480.pdf; ComponentLink6URL: https://datasheet.ciiva.com/17208/aoa0000ce2-17208153.pdf; ComponentLink6Description: https://datasheet.ciiva.com/17208/aoa0000ce2-17208153.pdf; ComponentLink7URL: https://datasheet.ciiva.com/22667/1678782-22667897.pdf; ComponentLink7Description: https://datasheet.ciiva.com/22667/1678782-22667897.pdf; ComponentLink8URL: https://datasheet.ciiva.com/24023/aoa0000ce2-24023497.pdf; ComponentLink8Description: https://datasheet.ciiva.com/24023/aoa0000ce2-24023497.pdf; ComponentLink9URL: https://datasheet.ciiva.com/7830/426256-7830746.pdf; ComponentLink9Description: https://datasheet.ciiva.com/7830/426256-7830746.pdf; ComponentLink10URL: https://datasheet.ciiva.com/30257/aoa0000ce2-30257690.pdf; ComponentLink10Description: https://datasheet.ciiva.com/30257/aoa0000ce2-30257690.pdf; ComponentLink11URL: https://datasheet.ciiva.com/7830/426256-7830988.pdf; ComponentLink11Description: https://datasheet.ciiva.com/7830/426256-7830988.pdf; ComponentLink12URL: https://datasheet.ciiva.com/16776/70260748-16776892.pdf; ComponentLink12Description: https://datasheet.ciiva.com/16776/70260748-16776892.pdf; ComponentLink13URL: https://datasheet.ciiva.com/16788/70260748-16788734.pdf; ComponentLink13Description: https://datasheet.ciiva.com/16788/70260748-16788734.pdf; ComponentLink14URL: https://datasheet.ciiva.com/48531/aoa0000ce2-48531486.pdf; ComponentLink14Description: https://datasheet.ciiva.com/48531/aoa0000ce2-48531486.pdf
R6 = RES_0805_11.8K: RES SMD 11.8K OHM 1% 1/8W 0805; Manufacturer: Yageo; Manufacturer Part Number: RC0805FR-0711K8L; Resistance: 11.8KR; Temperature Coefficient: 100ppm/°C; Voltage Rating (DC): 150V; Power Rating: 125mW; Supplier 1: Digi-Key; Supplier Part Number 1: 311-11.8KCRCT-ND; Stock 1: 69614; Pricing 1: 1=0.1, 10=0.022, 100=0.0088, 1000=0.004, 2500=0.0034 (USD); Case/Package: 0805; Contact Plating: Tin,Lead,Matte; Case Code (Metric): 2012; Case Code (Imperial): 0805; Min Operating Temperature: -55°C; Max Operating Temperature: 155°C; Tolerance: 1%; Packaging: Tape and Reel; Composition: Thick Film; Voltage Rating: 150V; Termination: SMD/SMT; Military Standard: Not; Package Quantity: 1; Number of Terminations: 2; Max Power Dissipation: 125mW; Length: 2mm; Height: 0.024inch; Width: 0.049inch; Depth: 1.25mm; Radiation Hardening: No; Lead Free: Lead Free; ComponentLink1URL: https://datasheet.ciiva.com/15189/getdatasheetpartid-498796-15189893.pdf; ComponentLink1Description: https://datasheet.ciiva.com/15189/getdatasheetpartid-498796-15189893.pdf; ComponentLink2URL: https://datasheet.ciiva.com/2509/pyu-r-int-thick-7-2509453.pdf; ComponentLink2Description: https://datasheet.ciiva.com/2509/pyu-r-int-thick-7-2509453.pdf; ComponentLink3URL: https://datasheet.ciiva.com/2509/pyu-r-int-thick-7-2509454.pdf; ComponentLink3Description: https://datasheet.ciiva.com/2509/pyu-r-int-thick-7-2509454.pdf; ComponentLink4URL: https://datasheet.ciiva.com/2509/pyu-r-int-thick-7-2509455.pdf; ComponentLink4Description: https://datasheet.ciiva.com/2509/pyu-r-int-thick-7-2509455.pdf
R7-R11 = RES_0805_10K: RES, THICK FILM, 10K, 5%, 0.125W, 0805; Manufacturer: Yageo; Manufacturer Part Number: RC0805JR-0710KL; Power Rating: 125mW; Voltage Rating: 150V; Temperature Coefficient: 100ppm/°C; Supplier 1: Digi-Key; Stock 1: 1285290; Pricing 1: 1=0.1, 10=0.019, 100=0.0076, 1000=0.0034, 2500=0.003 (USD); Case/Package: 0805; Case Code (Imperial): 0805; Case Code (Metric): 2012; Contact Plating: Tin,Matte; Min Operating Temperature: -55°C; Max Operating Temperature: 155°C; Tolerance: 5%; Packaging: Tape and Reel; Termination: SMD/SMT; Composition: Thick Film; Military Standard: Not; Length: 2mm; Height: 0.5mm; Depth: 1.25mm; Width: 1.25mm; Radiation Hardening: No; REACH SVHC: Unknown; Lead Free: Lead Free; ComponentLink1URL: https://datasheet.ciiva.com/7983/444164-7983765.pdf; ComponentLink1Description: https://datasheet.ciiva.com/7983/444164-7983765.pdf; ComponentLink2URL: https://datasheet.ciiva.com/7941/444164-7941870.pdf; ComponentLink2Description: https://datasheet.ciiva.com/7941/444164-7941870.pdf; ComponentLink3URL: https://datasheet.ciiva.com/7941/444164-7941871.pdf; ComponentLink3Description: https://datasheet.ciiva.com/7941/444164-7941871.pdf; Supplier Part Number 1: 311-10KARCT-ND
ROT1 = ROT_ENCODER: Encoders 15mm SHAFT w/SWITCH; Manufacturer: Bourns; Manufacturer Part Number: PEC11R-4015F-S0024; Number of Channels: 2; Encoder Type: Mechanical; Pulses per Revolution: 24; Detent: No; Output Type: Quadrature,Incremental; Built in Switch: Yes; Hole Diameter: 1.8mm; Supplier 1: Digi-Key; Stock 1: 2755; Pricing 1: 1=1.68, 10=1.566, 25=1.4792, 50=1.305, 100=1.073, 250=1.044, 500=0.986, 1000=0.928, 5000=0.812 (USD); Mount: Through Hole,Panel,PCB; Number of Pins: 5; Min Operating Temperature: -30°C; Max Operating Temperature: 70°C; Packaging: Bulk; Package Quantity: 75; Termination: PC Pin; Orientation: Vertical; Length: 21.5mm; Height: 13.4mm; Width: 12.5mm; Radiation Hardening: No; REACH SVHC: No SVHC; ComponentLink1URL: https://datasheet.ciiva.com/29349/pec11r-29349519.pdf; ComponentLink1Description: https://datasheet.ciiva.com/29349/pec11r-29349519.pdf; Supplier Part Number 1: PEC11R-4015F-S0024-ND
SPKR1 = CDS-27204-L100: 4 Ohm Magnetic Speaker 2W 20Hz ~ 20kHz Top Rectangular 93dB; Manufacturer: CUI; Impedance: 4R; Max Power Dissipation: 2.5W; Max Current Rating: 16A; Max Supply Voltage: 250V; Number of Poles: 2; Number of Levels: 1; Current: 18A; Voltage: 300V; Voltage Rating (DC): 320V; Connector Type: Screw; Wire Gauge (Max): 26AWG; Wire Gauge (Min): 12AWG; Pitch: 5mm; Wire/Cable Gauge: 14AWG; Approvals: UL; Supplier 1: Digi-Key; Manufacturer Part Number: CDS-27204-L100; Stock 1: 445; Pricing 1: 1=3.55, 10=3.179, 25=2.8052, 50=2.5246, 100=2.4871, 250=2.3842, 500=2.2908, 1000=2.244 (USD); Shape: Rectangular; Power Rating: 2W; Termination: Wire Leads; Length: 27mm; Height: 6.1mm; Width: 20mm; Lead Free: Lead Free; Supplier Part Number 1: 102-3547-ND; Supplier 2: Digi-Key; Stock 2: 16172; Pricing 2: 1=0.38, 10=0.368, 50=0.352, 100=0.3424, 250=0.32, 500=0.2944, 1000=0.272 (USD); Mount: Through Hole; Weight: 0.067021oz; Colour: Green; Material: Nylon; Housing Colour: Green; Housing Material: Polyamide; Insulation Material: Nylon; Number of Rows: 1; Current Rating: 16A; Voltage Rating: 250V; Package Quantity: 250; Packaging: Bulk; Number of Positions: 2; Number of Positions Per Level: 2; Number of Contacts: 2; Number of Circuits: 2; Orientation: Straight; Depth: 9mm; Radiation Hardening: No; Flammability Rating: UL94 V-0; ComponentLink1URL: https://datasheet.ciiva.com/824/combiconcompact5-0mmseries-824222.pdf; ComponentLink1Description: https://datasheet.ciiva.com/824/combiconcompact5-0mmseries-824222.pdf; ComponentLink2URL: https://datasheet.ciiva.com/15169/getdatasheetpartid-177903-15169663.pdf; ComponentLink2Description: https://datasheet.ciiva.com/15169/getdatasheetpartid-177903-15169663.pdf; ComponentLink3URL: https://datasheet.ciiva.com/16047/1935161-16047247.pdf; ComponentLink3Description: https://datasheet.ciiva.com/16047/1935161-16047247.pdf; Supplier Part Number 2: 277-1667-ND
SW1 = BUTTON: ...It's a button!; link: https://www.sparkfun.com/products/11996
U1 = TXS0108: TRANSLATOR, VOLTAGE, 8BIT, 20TSSOP; Manufacturer: Texas Instruments; Manufacturer Part Number: TXS0108EPWR; Output Current: 620µA; Propagation Delay: 4.8ns; Logic Case Style: TSSOP; No. of Pins: 20; Supply Voltage Min: 1.2V; Logic Type: Voltage Level Translator; Supply Voltage Max: 5.5V; No. of Inputs: 8; SVHC: No SVHC (16-Jun-2014); Supplier 1: Digi-Key; Stock 1: 41812; Pricing 1: 1=1.7, 10=1.523, 100=1.2242, 500=1.0058, 1000=0.8334 (USD); Operating Temperature Min: -40°C; Operating Temperature Max: 85°C; Packaging: Cut Tape; MSL: MSL 1 - Unlimited; ComponentLink1URL: https://datasheet.ciiva.com/14287/txs0108e-14287280.pdf; ComponentLink1Description: https://datasheet.ciiva.com/14287/txs0108e-14287280.pdf; ComponentLink2URL: https://datasheet.ciiva.com/4834/sces642b-127094-4834401.pdf; ComponentLink2Description: https://datasheet.ciiva.com/4834/sces642b-127094-4834401.pdf; ComponentLink3URL: https://datasheet.ciiva.com/30509/txs0108epwr-30509699.pdf; ComponentLink3Description: https://datasheet.ciiva.com/30509/txs0108epwr-30509699.pdf; ComponentLink4URL: https://datasheet.ciiva.com/1899/txs0108e-1899604.pdf; ComponentLink4Description: https://datasheet.ciiva.com/1899/txs0108e-1899604.pdf; ComponentLink5URL: https://datasheet.ciiva.com/15096/getdatasheetpartid-322119-15096276.pdf; ComponentLink5Description: https://datasheet.ciiva.com/15096/getdatasheetpartid-322119-15096276.pdf; ComponentLink6URL: https://datasheet.ciiva.com/1899/txs0108e-1899605.pdf; ComponentLink6Description: https://datasheet.ciiva.com/1899/txs0108e-1899605.pdf; ComponentLink7URL: https://datasheet.ciiva.com/28653/1714661-28653429.pdf; ComponentLink7Description: https://datasheet.ciiva.com/28653/1714661-28653429.pdf; ComponentLink8URL: https://datasheet.ciiva.com/1899/txs0108e-1899606.pdf; ComponentLink8Description: https://datasheet.ciiva.com/1899/txs0108e-1899606.pdf; ComponentLink9URL: https://datasheet.ciiva.com/1508/1815244-1508732.pdf; ComponentLink9Description: https://datasheet.ciiva.com/1508/1815244-1508732.pdf; ComponentLink10URL: https://datasheet.ciiva.com/14287/txs0108e-14287532.pdf; ComponentLink10Description: https://datasheet.ciiva.com/14287/txs0108e-14287532.pdf; ComponentLink11URL: https://datasheet.ciiva.com/26039/txs0108e-26039599.pdf; ComponentLink11Description: https://datasheet.ciiva.com/26039/txs0108e-26039599.pdf; Supplier Part Number 1: 296-23011-1-ND
U2 = LMZ12003: POWER MODULE, TO-PMOD-7, FULL REEL; Manufacturer: Texas Instruments; Manufacturer Part Number: LMZ12003TZ-ADJ/NOPB; Min Input Voltage: 4.5V; Max Input Voltage: 20V; Number of Outputs: 1; Output Current: 3A; Output Voltage: 6V; Switching Frequency: 1MHz; Efficiency: 92%; Min Output Voltage: 800mV; Quiescent Current: 1mA; Max Power Dissipation: 18W; Supplier 1: Digi-Key; Stock 1: 0; Pricing 1: 1=9.05, 5=8.986, 10=8.918, 25=8.7804, 50=8.5062, 100=7.683 (USD); Mount: Surface Mount; Number of Pins: 8; Min Operating Temperature: -40°C; Max Operating Temperature: 125°C; Packaging: Tape and Reel; Package Quantity: 1; Voltage - Output 1: 6V; Max Output Current: 3A; Max Output Voltage: 6V; Length: 0.4inch; Height: 0.18inch; Width: 0.54inch; REACH SVHC: No SVHC; Lead Free: Lead Free; ComponentLink1URL: https://datasheet.ciiva.com/48695/001207013-da-01-en-ic-buc-lmz12003tz-adj-nopb-to-pmod-7-tid-48695238.pdf; ComponentLink1Description: https://datasheet.ciiva.com/48695/001207013-da-01-en-ic-buc-lmz12003tz-adj-nopb-to-pmod-7-tid-48695238.pdf; Supplier Part Number 1: LMZ12003TZ-ADJ/NOPBCT-ND
U3-U22 = APA102: SPI LED; LINK: https://www.adafruit.com/product/2343
U23 = SN74LVC1G17: IC BUFFER SCHMIT TRIG SOT23-5; Manufacturer: Texas Instruments; Manufacturer Part Number: SN74LVC1G17DBVR; Logic Function: Schmitt Trigger,Buffer; Number of Channels: 1; Max Supply Voltage: 5.5V; Min Supply Voltage: 1.65V; Propagation Delay: 5ns; High Level Output Current: -32mA; Low Level Output Current: 32mA; Polarity: Non-Inverting; Quiescent Current: 1.5uA; Turn-On Delay Time: 11ns; Schmitt Trigger Input: Yes; Supplier 1: Digi-Key; Stock 1: 68193; Pricing 1: 1=0.43, 10=0.32, 100=0.1996, 500=0.1366, 1000=0.1051 (USD); Mount: Surface Mount; Case/Package: SOT-23; Number of Pins: 5; Contact Plating: Tin,Matte; Min Operating Temperature: -40°C; Max Operating Temperature: 125°C; Number of Inputs: 1; Number of Outputs: 1; Packaging: Tape and Reel; Package Quantity: 3000; Number of Elements: 1; Number of Bits per Element: 1; Number of Input Lines: 1; Number of Output Lines: 1; Termination: SMD/SMT; Number of Gates: 1; Number of Bits: 1; Length: 2.9mm; Height: 1.15mm; Width: 1.6mm; Radiation Hardening: No; REACH SVHC: No SVHC; Lead Free: Lead Free; ComponentLink1URL: https://datasheet.ciiva.com/34301/756684-34301476.pdf; ComponentLink1Description: https://datasheet.ciiva.com/34301/756684-34301476.pdf; ComponentLink2URL: https://datasheet.ciiva.com/1833/sn74lvc1g17-1833621.pdf; ComponentLink2Description: https://datasheet.ciiva.com/1833/sn74lvc1g17-1833621.pdf; ComponentLink3URL: https://datasheet.ciiva.com/7744/1811088-7744197.pdf; ComponentLink3Description: https://datasheet.ciiva.com/7744/1811088-7744197.pdf; ComponentLink4URL: https://datasheet.ciiva.com/28594/1772570-28594805.pdf; ComponentLink4Description: https://datasheet.ciiva.com/28594/1772570-28594805.pdf; ComponentLink5URL: https://datasheet.ciiva.com/1833/sn74lvc1g17-1833622.pdf; ComponentLink5Description: https://datasheet.ciiva.com/1833/sn74lvc1g17-1833622.pdf; ComponentLink6URL: https://datasheet.ciiva.com/1833/sn74lvc1g17-1833623.pdf; ComponentLink6Description: https://datasheet.ciiva.com/1833/sn74lvc1g17-1833623.pdf; ComponentLink7URL: https://datasheet.ciiva.com/15094/getdatasheetpartid-189714-15094971.pdf; ComponentLink7Description: https://datasheet.ciiva.com/15094/getdatasheetpartid-189714-15094971.pdf; ComponentLink8URL: https://datasheet.ciiva.com/48702/001073974-da-01-en-ic-buffer-s-sn74lvc1g17dbvr-sot-23-5-tid-48702678.pdf; ComponentLink8Description: https://datasheet.ciiva.com/48702/001073974-da-01-en-ic-buffer-s-sn74lvc1g17dbvr-sot-23-5-tid-48702678.pdf; Supplier Part Number 1: 296-11933-1-ND
U24 = NC7SZ157: FAIRCHILD SEMICONDUCTOR         NC7SZ157P6X             Logic Type:Multiplexer; Number of Outputs: 1; Throw Configuration: DPST; Propagation Delay: 3.7ns; Number of Inputs: 2; Logic Function: Multiplexer,Inverting,Mux; Max Supply Voltage: 5.5V; Max Power Dissipation: 180mW; High Level Output Current: 32mA; Supply Type: Single; Supplier 1: Digi-Key; Manufacturer: Fairchild Semiconductor; Manufacturer Part Number: NC7SZ157P6X; Stock 1: 29001; Pricing 1: 1=0.47, 10=0.349, 100=0.1978, 500=0.131, 1000=0.1004 (USD); Mount: Surface Mount; Case/Package: SC; Number of Pins: 6; Weight: 0.028g; Number of Terminals: 6; Contact Plating: Tin,Matte; Min Operating Temperature: -40°C; Max Operating Temperature: 85°C; Packaging: Tape and Reel; Number of Circuits: 1; Package Quantity: 3000; Number of Channels: 1; Low Level Output Current: 32mA; Number of Input Lines: 2; Number of Output Lines: 1; Power Dissipation: 180mW; Independent Circuits: 1; Length: 2mm; Height: 1mm; Width: 1.25mm; Radiation Hardening: No; REACH SVHC: No SVHC; Lead Free: Lead Free; ComponentLink1URL: https://datasheet.ciiva.com/27050/874365-27050578.pdf; ComponentLink1Description: https://datasheet.ciiva.com/27050/874365-27050578.pdf; ComponentLink2URL: https://datasheet.ciiva.com/1888/nc7sz157-1888131.pdf; ComponentLink2Description: https://datasheet.ciiva.com/1888/nc7sz157-1888131.pdf; ComponentLink3URL: https://datasheet.ciiva.com/1888/nc7sz157-1888132.pdf; ComponentLink3Description: https://datasheet.ciiva.com/1888/nc7sz157-1888132.pdf; ComponentLink4URL: https://datasheet.ciiva.com/1509/680929-1509109.pdf; ComponentLink4Description: https://datasheet.ciiva.com/1509/680929-1509109.pdf; ComponentLink5URL: https://datasheet.ciiva.com/1888/nc7sz157-1888133.pdf; ComponentLink5Description: https://datasheet.ciiva.com/1888/nc7sz157-1888133.pdf; ComponentLink6URL: https://datasheet.ciiva.com/1509/680929-1509110.pdf; ComponentLink6Description: https://datasheet.ciiva.com/1509/680929-1509110.pdf; ComponentLink7URL: https://datasheet.ciiva.com/17012/nc7sz157-17012088.pdf; ComponentLink7Description: https://datasheet.ciiva.com/17012/nc7sz157-17012088.pdf; ComponentLink8URL: https://datasheet.ciiva.com/3305/nc7sz157-3305418.pdf; ComponentLink8Description: https://datasheet.ciiva.com/3305/nc7sz157-3305418.pdf; ComponentLink9URL: https://datasheet.ciiva.com/3305/nc7sz157-3305419.pdf; ComponentLink9Description: https://datasheet.ciiva.com/3305/nc7sz157-3305419.pdf; ComponentLink10URL: https://datasheet.ciiva.com/15087/getdatasheetpartid-138973-15087148.pdf; ComponentLink10Description: https://datasheet.ciiva.com/15087/getdatasheetpartid-138973-15087148.pdf; Supplier Part Number 1: NC7SZ157P6XCT-ND